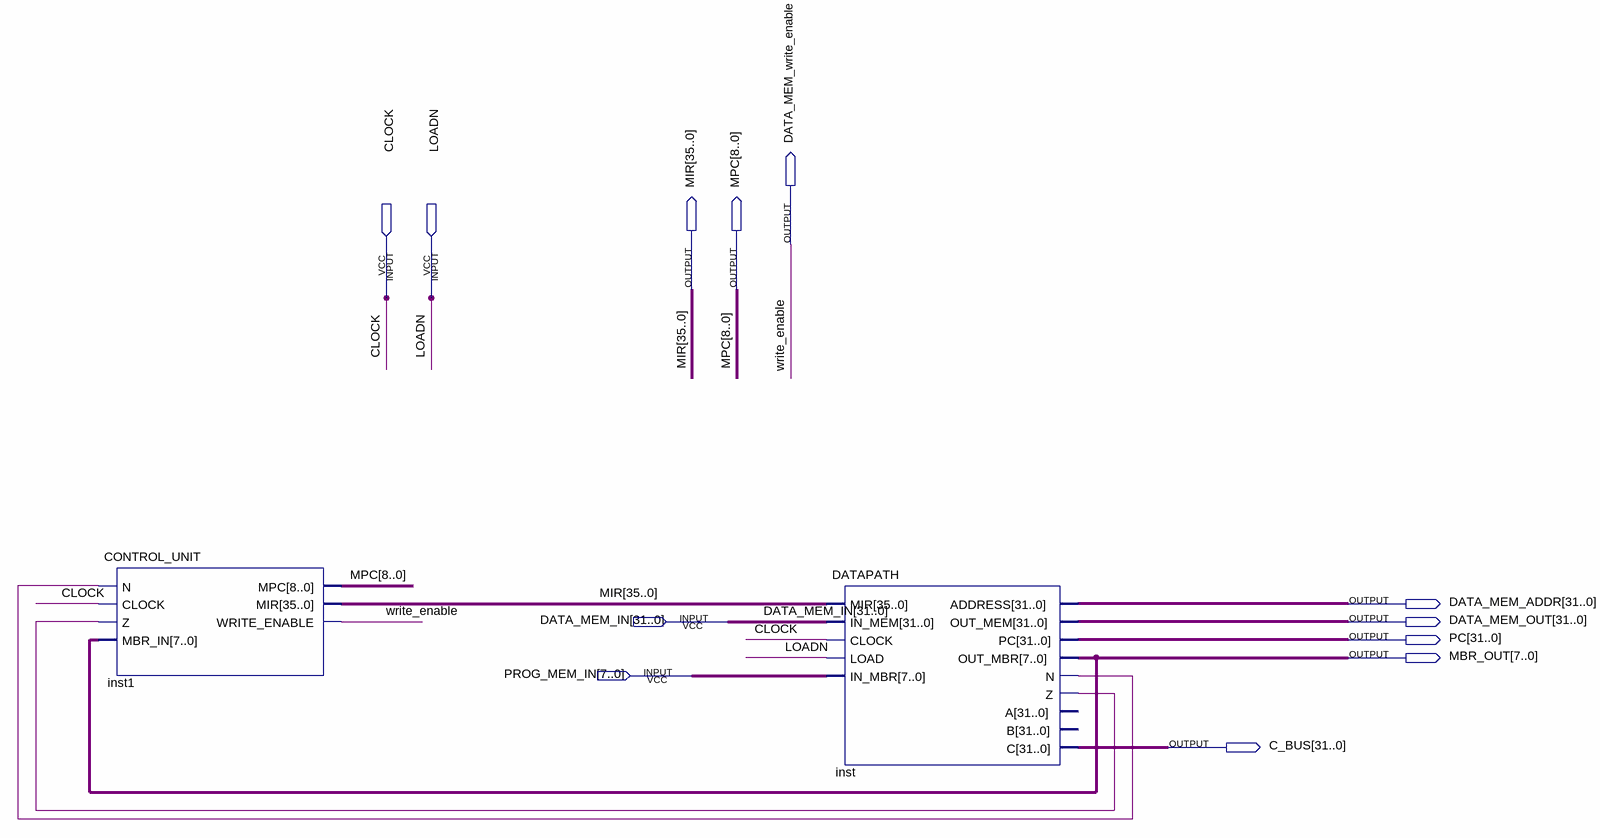
[diagram p0: schematic sheet]
// Quartus schematic CPU.bdf as structural Verilog: 2 symbols, 12 pins
module CPU (
  input  CLOCK,
  input  LOADN,
  input  [31:0] DATA_MEM_IN,
  input  [7:0] PROG_MEM_IN,
  output DATA_MEM_write_enable,
  output [35:0] MIR,
  output [8:0] MPC,
  output [31:0] DATA_MEM_ADDR,
  output [31:0] DATA_MEM_OUT,
  output [31:0] PC,
  output [7:0] MBR_OUT,
  output [31:0] C_BUS
);

  wire inst_n, inst_z;

  CONTROL_UNIT inst1 (
    .N(inst_n), .CLOCK(CLOCK), .Z(inst_z), .MBR_IN(MBR_OUT), .MPC(MPC), .MIR(MIR),
    .WRITE_ENABLE(DATA_MEM_write_enable));
  DATAPATH inst (
    .MIR(MIR), .IN_MEM(DATA_MEM_IN), .CLOCK(CLOCK), .LOAD(LOADN), .IN_MBR(PROG_MEM_IN),
    .ADDRESS(DATA_MEM_ADDR), .OUT_MEM(DATA_MEM_OUT), .PC(PC), .OUT_MBR(MBR_OUT), .N(inst_n), .Z(inst_z),
    .C(C_BUS));  // open: A, B

  // Other names for the same wires on the sheet: write_enable = DATA_MEM_write_enable
endmodule
